# Altium schematic sheet Power_supply.SchDoc: Power supply
size A4; Date: 31.12.2020.; CheckedBy: Goran Vidakovic; CompanyName: Sigmoid DOO, Novi Sad; DrawnBy: Nikolina Bratic; SheetNumber: 2; SheetTotal: 4
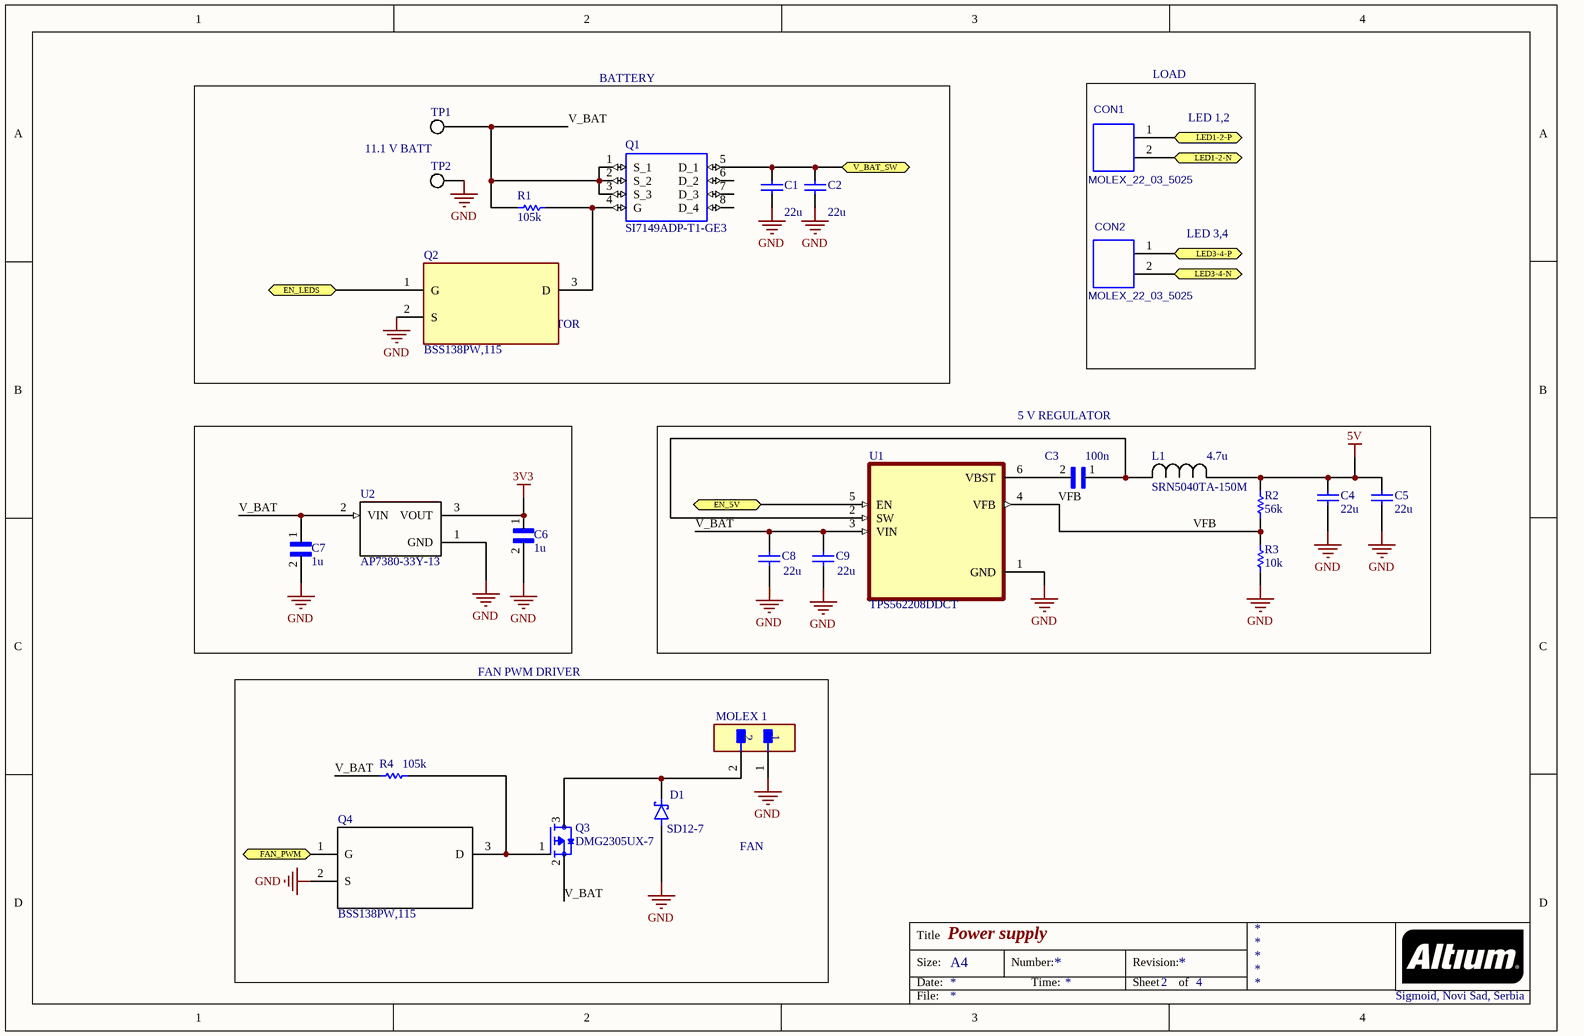
[diagram p0: Power_supply.SchDoc]

## Parts
C1  value 22u  [Capacitor SMD 1206]  (hidden comment: SMD Capacitor)
C2  value 22u  [Capacitor SMD 1206]  (hidden comment: SMD Capacitor)
C3  value 100n  [CAPC0402X22N]  (hidden comment: GRM0225C1E4R6CA03L_1)
C4  value 22u  [Capacitor SMD 0603]  (hidden comment: SMD Capacitor)
C5  value 22u  [Capacitor SMD 0603]  (hidden comment: SMD Capacitor)
C6  value 1u  [CAPC0402X22N]  (hidden comment: GRM0225C1E4R6CA03L_1)
C7  value 1u  [CAPC0402X22N]  (hidden comment: GRM0225C1E4R6CA03L_1)
C8  value 22u  [Capacitor SMD 1206]  (hidden comment: SMD Capacitor)
C9  value 22u  [Capacitor SMD 1206]  (hidden comment: SMD Capacitor)
CON1  MOLEX_22_03_5025  [MOLEX_22-03-5025]
CON2  MOLEX_22_03_5025  [MOLEX_22-03-5025]
D1  SD12-7  [SOD323]
L1  SRN5040TA-150M  [IND_A-150M]
MOLEX_1  CONN HEADER VERT 2POS 2MM  [TE_Connectivity_0_MFG]  (value not drawn)
Q1  SI7149ADP-T1-GE3  [POWERPAKSO-8]
Q2  BSS138PW,115  [SOT65P210X110-3N]
Q3  DMG2305UX-7  [SOT91P240X110-3N_DMG2305UX-7 - duplicate]
Q4  BSS138PW,115  [SOT65P210X110-3N]
R1  SMD Resistor  [RESC1005X35N]  (value not drawn)
R2  value 56k  [RESC1005X35N]  (hidden comment: SMD Resistor)
R3  value 10k  [RESC1005X35N]  (hidden comment: SMD Resistor)
R4  value 105k  [Resistor SMD 0603]  (hidden comment: SMD Resistor)
TP1  Test Point  [TEST POINT]  (value not drawn)
TP2  Test Point  [TEST POINT]  (value not drawn)
U1  TPS562208DDCT  [SOT95P280X110-6N]
U2  AP7380-33Y-13  [VREG_AP7380-33Y-13]

## Blocks framed on the sheet
5 V REGULATOR: C3-C5 C8 C9 L1 R2 R3 U1

## Ports
EN_5V, EN_LEDS, FAN_PWM, LED1-2-N, LED1-2-P, LED3-4-N, LED3-4-P, V_BAT_SW

## Nets
3V3: C6.1 U2.3(VOUT)
5V: C4.2 C5.2 L1.1 R2.2
GND: C1.1 C2.1 C4.1 C5.1 C6.2 C7.2 C8.1 C9.1 D1.A MOLEX_1.1 Q2.2(S) Q4.2(S) R3.1 TP2.1 U1.1(GND) U2.1(GND)
EN_5V: U1.5(EN) ; port EN_5V
EN_LEDS: Q2.1(G) ; port EN_LEDS
FAN_PWM: Q4.1(G) ; port FAN_PWM
LED1-2-N: CON1.2 ; port LED1-2-N
LED1-2-P: CON1.1 ; port LED1-2-P
LED3-4-N: CON2.2 ; port LED3-4-N
LED3-4-P: CON2.1 ; port LED3-4-P
V_BAT: C7.1 C8.2 C9.2 Q1.1(S_1) Q1.2(S_2) Q1.3(S_3) Q3.2(S) R1.2 R4.1 TP1.1 U1.3(VIN) U2.2(VIN)
V_BAT_SW: C1.2 C2.2 Q1.5(D_1) ; port V_BAT_SW
VFB: R2.1 R3.2 U1.4(VFB)
NetC3_1: C3.1 L1.2 U1.2(SW)
NetC3_2: C3.2 U1.6(VBST)
NetD1_C: D1.C(K) MOLEX_1.2 Q3.3(D)
NetQ1_4: Q1.4(G) Q2.3(D) R1.1
NetQ3_1: Q3.1(G) Q4.3(D) R4.2

Not connected (* = marked no-connect by the designer): Q1 6(D_2) 7(D_3) 8(D_4)

## Notes on the sheet
- BATTERY
- LOAD
- 11.1 V BATT
- LED 1,2
- LED 3,4
- (near Q2) 3.3 V REGULATOR
- FAN PWM DRIVER
- FAN
- Sigmoid, Novi Sad, Serbia
- Title
- Size:
- Date:
- A4
- Number:
- Time:
- Revision:
- Sheet
- of
- File:
- (in symbol SRN5040TA-150M) 4.7u

## Library data of the parts
C3 C6 C7 = GRM0225C1E4R6CA03L_1: SMD Capacitor C0G(EIA) with Capacitance: 4.6pF Tol. 0.25pF. Rated Voltage: 25Vdc; Package: None; Price: None; MP: GRM0225C1E4R6CA03L; Availability: Unavailable
CON1 CON2 = KONEKTOR 2-POLNI_X8Y6: KONEKTOR 2 MOLEX; Value: *
D1 = MBRS340: Diode, Signal, TVS, 12V, Unidir. (SOD323); MF: ON Semiconductor; SnapEDA_Link: https://www.snapeda.com/parts/MBRS340/ON%20Semiconductor/view-part/1473135/?ref=snap; Value: *; MP: MBRS340; Availability: Unavailable; Package: DO-214 ON Semiconductor; DigiKey-Purchase-URL: https://snapeda.com/shop?store=DigiKey&id=1473135; Price: None
L1 = SRN5040TA-150M: Fixed Inductors 3.3uH 20% SMD 5040; Vendor: Bourns Electronics; Built_By: EMA_Matt; SourceLibrary: Bourns_Electronics_2019-12-18; Type: DEV; Manufacturer_Part_Number: SRN5040TA-150M; Copyright: Copyright (C) 2018 Accelerated Designs. All rights reserved; RefDes: RefDes
MOLEX_1 = 53253-0270: Connector Header Through Hole 2 position 0.079" (2.00mm)
Q1 = SI7149ADP-T1-GE3: P-Channel 30V 50A (Tc) 5W (Ta), 48W (Tc) Surface Mount PowerPAKÂ® SO-8; MF: Vishay Siliconix; Availability: Good; Purchase-URL: https://pricing.snapeda.com/search/part/SI7149ADP-T1-GE3/?ref=eda; SnapEDA_Link: https://www.snapeda.com/parts/SI7149ADP-T1-GE3/Vishay%20Siliconix/view-part/415842/?ref=snap; MP: SI7149ADP-T1-GE3; Price: None; Value: *; Check_prices: https://www.snapeda.com/parts/SI7149ADP-T1-GE3/Vishay%20Siliconix/view-part/415842/?ref=eda; Package: SO-8 Vishay
Q2 Q4 = BSS138PW,115: N-Channel 60V 320mA _Ta_ 260mW _Ta_, 830mW _Tc_ Surface Mount SC-70; MF: Nexperia USA; Digi-Key_Part_Number: 1727-1143-1-ND; SnapEDA_Link: https://www.snapeda.com/parts/BSS138PW%2C115/Nexperia%20USA%20Inc./view-part/209423/?ref=snap; Package: SOT-323 NXP Semiconductors; MP: BSS138PW,115; Digi-Key_Purchase_URL: https://www.digikey.com/product-detail/en/nexperia-usa-inc/BSS138PW,115/1727-1143-1-ND/4162472?utm_source=snapeda&utm_medium=aggregator&utm_campaign=symbol; Value: *
Q3 = DMG2305UX-7: P-Channel 20V 4.2A _Ta_ 1.4W _Ta_ Surface Mount SOT-23; MF: Power Analog Micro; SnapEDA_Link: https://www.snapeda.com/parts/DMG2305UX-7/Power%20Analog%20Micro/view-part/174848/?ref=snap; Price: None; MP: DMG2305UX-7; Package: TO-236-3 Power Analog Micro; Value: *; Availability: Unavailable
U1 = TPS562208DDCT: 4.5 V to 17 V input, 2 A output, synchronous step-down converter in FCCM mode 6-SOT-23-THIN -40 to 125; MF: Texas Instruments; Value: *; MP: TPS562208DDCT; Availability: Good; DigiKey-Purchase-URL: https://snapeda.com/shop?store=DigiKey&id=652146; SnapEDA_Link: https://www.snapeda.com/parts/TPS562208DDCT/Texas%20Instruments/view-part/652146/?ref=snap; Price: None; Mouser-Purchase-URL: https://snapeda.com/shop?store=Mouser&id=652146; Texas_Instruments-Purchase-URL: https://snapeda.com/shop?store=Texas+Instruments&id=652146; Package: SOT-23-THN-6 Texas Instruments
U2 = AP7380-33Y-13: LDO Regulator Pos 3.3V 0.15A 4-Pin(3+Tab) SOT-89 T/R; MF: Diodes Incorporated; MP: AP7380-33Y-13; SnapEDA_Link: https://www.snapeda.com/parts/AP7380-33Y-13/Diodes%20Inc./view-part/4834117/?ref=snap; Value: *; Arrow_Electronics-Purchase-URL: https://snapeda.com/shop?store=Arrow+Electronics&id=4834117; Package: None; Price: None; Mouser-Purchase-URL: https://snapeda.com/shop?store=Mouser&id=4834117; Availability: Unavailable
R1-R4 = SMD Resistor
  R1: 105k: 105k